# Altium schematic sheet 01.SchDoc
size A4
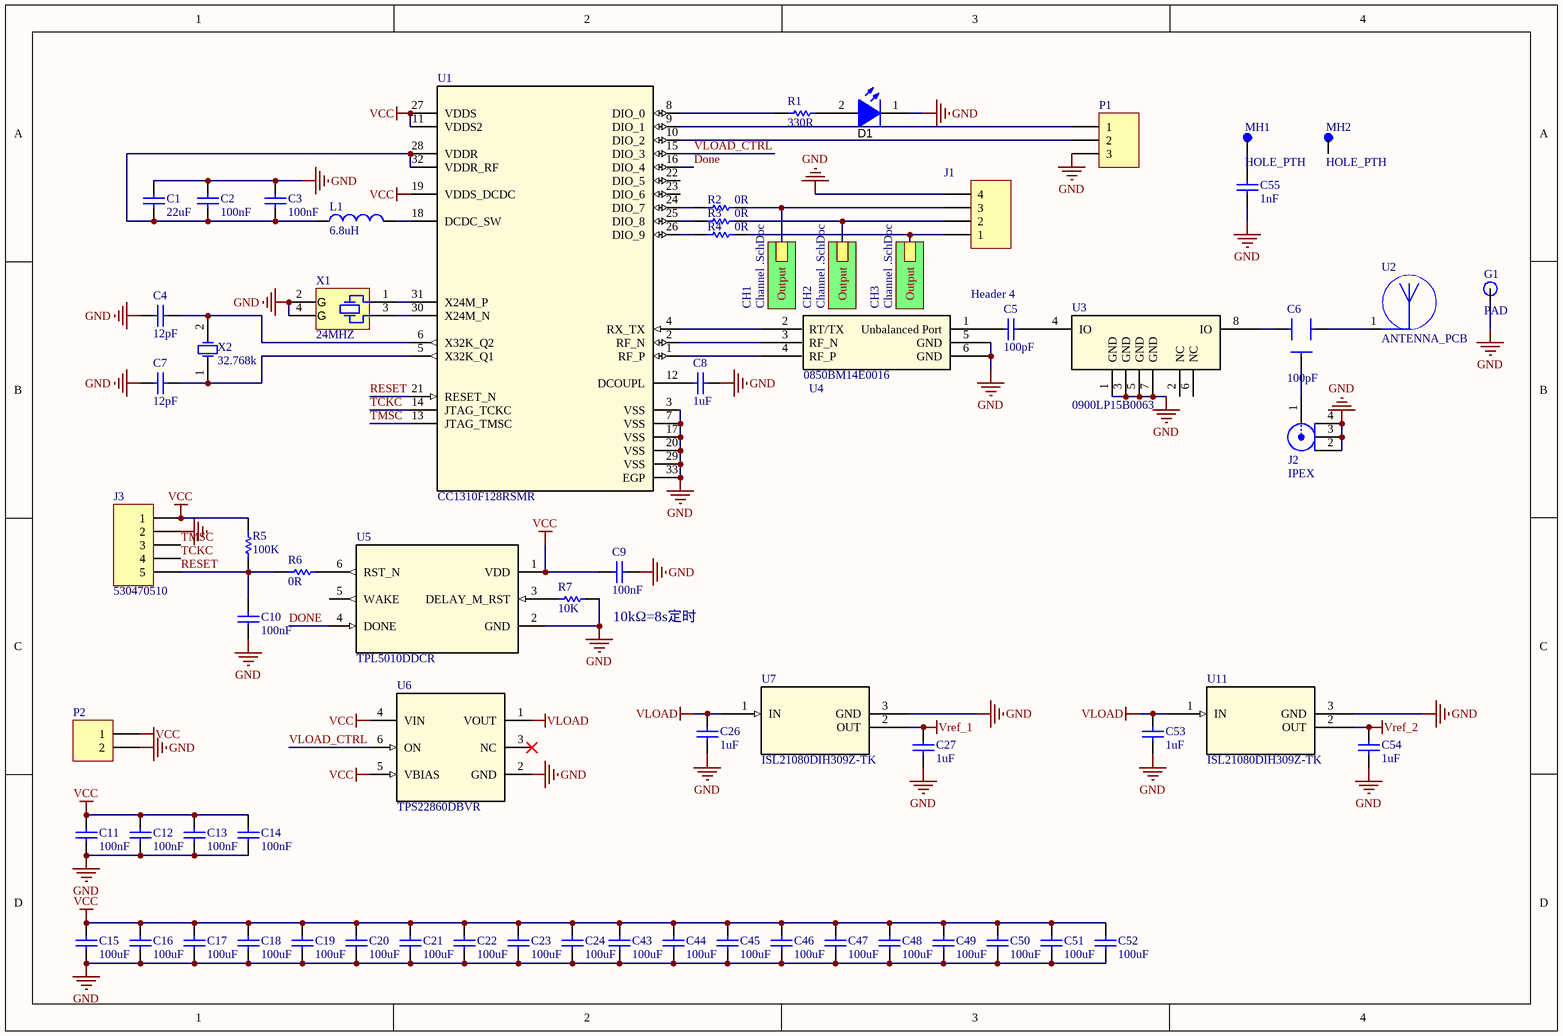
[diagram p0: 01.SchDoc]

## Parts
C1  22uF  [S0805C]
C2  100nF  [S0603C]
C3  100nF  [S0603C]
C4  12pF  [S0402C]
C5  100pF  [S0402C]
C6  100pF  [ST0402C]
C7  12pF  [S0402C]
C8  1uF  [S0603C]
C9  100nF  [S0603C]
C10  100nF  [S0603C]
C11  100nF  [S0603C]
C12  100nF  [S0603C]
C13  100nF  [S0603C]
C14  100nF  [S0603C]
C15  100uF  [S1210C]
C16  100uF  [S1210C]
C17  100uF  [S1210C]
C18  100uF  [S1210C]
C19  100uF  [S1210C]
C20  100uF  [S1210C]
C21  100uF  [S1210C]
C22  100uF  [S1210C]
C23  100uF  [S1210C]
C24  100uF  [S1210C]
C26  1uF  [S0603C]
C27  1uF  [S0603C]
C43  100uF  [S1210C]
C44  100uF  [S1210C]
C45  100uF  [S1210C]
C46  100uF  [S1210C]
C47  100uF  [S1210C]
C48  100uF  [S1210C]
C49  100uF  [S1210C]
C50  100uF  [S1210C]
C51  100uF  [S1210C]
C52  100uF  [S1210C]
C53  1uF  [S0603C]
C54  1uF  [S0603C]
C55  1nF  [S0805C]
D1  MHT192WDT-C2  [LED0603]  (value not drawn)
G1  PAD  [P3X2]
J1  Header 4  [CP1X4]
J2  IPEX  [molex-73412]
J3  530470510  [1.25mm_p5]
L1  6.8uH  [S0805L]
MH1  HOLE_PTH  [Pad_2-5_3]
MH2  HOLE_PTH  [Pad_2-5_3]
P1  Header 3  [CP1X3]  (value not drawn)
P2  Header 2  [CP1X2]  (value not drawn)
R1  330R  [S0603R]
R2  0R  [S0603R]
R3  0R  [S0603R]
R4  0R  [S0603R]
R5  100K  [S0603R]
R6  0R  [S0603R]
R7  10K  [S0603R]
U1  CC1310F128RSMR  [RSM0032B_NV]
U2  ANTENNA_PCB  [P1X1]
U3  0900LP15B0063  [8P0805]
U4  0850BM14E0016  [6P0603]
U5  TPL5010DDCR  [DDC0006A_N]
U6  TPS22860DBVR  [DBV0006A_N]
U7  ISL21080DIH309Z-TK  [SOT-23]
U11  ISL21080DIH309Z-TK  [SOT-23]
X1  24MHZ  [SMD-2016]
X2  32.768k  [SMD-2012]

## Sub-sheets
CH1 = Channel .SchDoc: Output
CH2 = Channel .SchDoc: Output
CH3 = Channel .SchDoc: Output

## Nets
GND: C1.1 C2.1 C3.1 C4.2 C7.2 C8.1 C9.2 C10.2 C11.2 C12.2 C13.2 C14.2 C15.1 C16.1 C17.1 C18.1 C19.1 C20.1 C21.1 C22.1 C23.1 C24.1 C26.2 C27.2 C43.1 C44.1 C45.1 C46.1 C47.1 C48.1 C49.1 C50.1 C51.1 C52.1 C53.2 C54.2 C55.1 D1.1(K) G1.1 J1.4 J2.2 J2.3 J2.4 J3.2 P1.3 P2.2 R7.2 U1.3(VSS) U1.7(VSS) U1.17(VSS) U1.20(VSS) U1.29(VSS) U1.33(EGP) U3.1(GND) U3.3(GND) U3.5(GND) U3.7(GND) U4.5(GND) U4.6(GND) U5.2(GND) U6.2(GND) U7.3(GND) U11.3(GND) X1.2(GND) X1.4(GND)
VCC: C9.1 C11.1 C12.1 C13.1 C14.1 C15.2 C16.2 C17.2 C18.2 C19.2 C20.2 C21.2 C22.2 C23.2 C24.2 C43.2 C44.2 C45.2 C46.2 C47.2 C48.2 C49.2 C50.2 C51.2 C52.2 J3.1 P2.1 R5.2 U1.11(VDDS2) U1.19(VDDS_DCDC) U1.27(VDDS) U5.1(VDD) U6.4(VIN) U6.5(VBIAS)
VLOAD: C26.1 C53.1 U6.1(VOUT) U7.1(IN) U11.1(IN)
Vref_1: C27.1 U7.2(OUT)
Vref_2: C54.1 U11.2(OUT)
DONE: U1.16(DIO_4) U5.4(DONE)
RESET: C10.1 J3.5 R5.1 R6.2 U1.21(RESET_N)
TCKC: J3.4 U1.14(JTAG_TCKC)
TMSC: J3.3 U1.13(JTAG_TMSC)
VLOAD_CTRL: U1.15(DIO_3) U6.6(ON)
NetC1_2: C1.2 C2.2 C3.2 L1.1 U1.28(VDDR) U1.32(VDDR_RF)
NetC4_1: C4.1 U1.6(X32K_Q2) X2.2(OSC2)
NetC5_1: C5.1 U4.1(Unbalanced_Port)
NetC5_2: C5.2 U3.4(IO)
NetC6_1: C6.1 U3.8(IO)
NetC6_2: C6.2 U2.1
NetC6_3: C6.3 J2.1
NetC7_1: C7.1 U1.5(X32K_Q1) X2.1(OSC1)
NetC8_2: C8.2 U1.12(DCOUPL)
NetC55_2: C55.2 MH1.1
NetD1_2: D1.2(A) R1.2
NetJ1_1: J1.1 R4.1 ; sheet CH3/Output
NetJ1_2: J1.2 R3.1 ; sheet CH2/Output
NetJ1_3: J1.3 R2.1 ; sheet CH1/Output
NetL1_2: L1.2 U1.18(DCDC_SW)
NetP1_1: P1.1 U1.9(DIO_1)
NetP1_2: P1.2 U1.10(DIO_2)
NetR1_1: R1.1 U1.8(DIO_0)
NetR2_2: R2.2 U1.24(DIO_7)
NetR3_2: R3.2 U1.25(DIO_8)
NetR4_2: R4.2 U1.26(DIO_9)
NetR6_1: R6.1 U5.6(RST_N)
NetR7_1: R7.1 U5.3(DELAY_M_RST)
NetU1_1: U1.1(RF_P) U4.4(RF_P)
NetU1_2: U1.2(RF_N) U4.3(RF_N)
NetU1_4: U1.4(RX_TX) U4.2(RT/TX)
NetU1_30: U1.30(X24M_N) X1.3
NetU1_31: U1.31(X24M_P) X1.1

Not connected (* = marked no-connect by the designer): MH2 1; U1 22(DIO_5) 23(DIO_6); U3 2(NC) 6(NC); U5 5(WAKE); U6 3(NC)*

## Notes on the sheet
- 10kΩ=8s定时
- (in symbol FA-128 24.000000MHz 12pF ±10ppm) G

## Library data of the parts
C1 = 22uF/0805/16V: 精度 ±20% / 容值 22uF / 额定电压 16V / 温漂系数（介质材料) X5R; Manufacturer: FH(风华); A_Manufacturer: 元六; Code: 0805X226M160NT; A_Code: J CT41-0805-2R2-16V-226M; CompType: Capacitor; A_ComType: 二类电容; DistributorCode: C129302; Package: 0805
C2 C3 C9-C14 = 100nF/0603/50V: 精度 ±10% / 容值 100nF / 额定电压 50V / 温漂系数（介质材料) X7R; Manufacturer: FH(风华); A_Manufacturer: 元六; Code: 0603B104K500NT; A_Code: J CT41-0603-2R1-50V-104K; CompType: Capacitor; A_ComType: 二类电容; DistributorCode: C30926; Package: 0603
C4 C7 = 12pF/0402/50V: 精度 ±1% / 容值 12pF / 额定电压 50V / 温漂系数（介质材料) C0G; Manufacturer: FH(风华); A_Manufacturer: 元六; Code: 0402CG120F500NT; A_Code: J CC41-0402-CG-50V-120J; CompType: Capacitor; A_ComType: 一类电容; DistributorCode: C182477; Package: 0402
C5 = 100pF/0402/50V: 精度 ±5% / 容值 100pF / 额定电压 50V / 温漂系数（介质材料) C0G; Manufacturer: FH(风华); A_Manufacturer: 元六; Code: 0402CG101J500NT; A_Code: J CC41-0402-CG-50V-101J; CompType: Capacitor; A_ComType: 一类电容; DistributorCode: C1546; Package: 0402
C6 = 100pF/0402/T: 精度 ±5% / 容值 100pF / 额定电压 50V / 温漂系数（介质材料) C0G; Manufacturer: FH(风华); A_Manufacturer: 元六; Code: 0402CG101J500NT; A_Code: J CC41-0402-CG-50V-101J; CompType: Capacitor; A_ComType: 一类电容; DistributorCode: C1546; Package: 0402
C8 C26 C27 C53 C54 = 1uF/0603/50V: 精度 ±10% / 容值 1uF / 额定电压 50V / 温漂系数（介质材料) X7R; Manufacturer: FH(风华); A_Manufacturer: 元六; Code: 0603B105K500NT; A_Code: J CT41-0603-2R1-50V-105M; CompType: Capacitor; A_ComType: 二类电容; DistributorCode: C90540; Package: 0603
C15-C24 C43-C52 = 100uF/1210/6.3V: 精度 ±20% / 容值 100uF / 额定电压 6.3V / 温漂系数（介质材料) X5R; Manufacturer: muRata(村田); A_Manufacturer: 元六; Code: GRM32ER60J107ME20L; A_Code: J CT41-1210-2R2-10V-107M; CompType: Capacitor; DistributorCode: C88154; Package: 1210
C55 = 1nF/0805/250V: 精度 ±10% / 容值 1nF / 额定电压 250V / 温漂系数（介质材料) X7R; Manufacturer: FH(风华); A_Manufacturer: 元六; Code: 0805B102K251NT; CompType: Capacitor; A_ComType: 二类电容; Package: 0805; DistributorCode: C285058
D1 = MHT192WDT-C2: LED SMD贴片0603顶部发光 / 黄色雾状胶体，高亮白色光 / 电压VF:2.6-3.1V@5mA / 亮度Iv:228-450mcd@5mA / 坐标x:0.3,y:0.3 / 发光角度:120deg; Manufacturer: MEIHUA(美华科技); CompType: LED; Code: MHT192WDT-C2; Package: 0603; DistributorCode: C389521; A_Code: -; A_ComType: -; A_Manufacturer: -
G1 = PAD: 地焊盘
J1 = Header 4: Header, 4-Pin; Code: -; CompType: -; DistributorCode: -; Manufacturer: -; Package: -; A_Code: -; A_ComType: -; A_Manufacturer: -
J2 = 73412-0110: RF同轴连接器（天线座）; Manufacturer: MOLEX; Code: 734120110; CompType: IPEX插座; DistributorCode: C434806; Package: SMD
J3 = 530470510: MX1.25 直插 镀锡 5P 针座; Manufacturer: MOLEX; CompType: 连接器; Code: 530470510; DistributorCode: C471412; Package: 1.25mm 5p; A_Code: -; A_ComType: -; A_Manufacturer: -
L1 = 6.8uH/0805_1: 精度 ±20% / 电感值 6.8uH / 直流电阻（内阻） 400mΩ / 额定电流 220mA; Manufacturer: TDK; A_Manufacturer: 振华富; Code: MLZ2012M6R8HT000; A_Code: PI2012F6R8; CompType: Inductor; DistributorCode: C524463; Package: 0805; A_ComType: -
MH1 MH2 = HOLE_2-5_3: 定位孔; Code: -; CompType: -; DistributorCode: -; Manufacturer: -; Package: -; A_Code: -; A_ComType: -; A_Manufacturer: -
P1 = Header 3: Header, 3-Pin; Code: -; CompType: -; DistributorCode: -; Manufacturer: -; Package: -; A_Code: -; A_ComType: -; A_Manufacturer: -
P2 = Header 2: Header, 2-Pin; Code: -; CompType: -; DistributorCode: -; Manufacturer: -; Package: -; A_Code: -; A_ComType: -; A_Manufacturer: -
R1 = 330R/0603: 精度 ±1% / 温度系数 ±100ppm/℃ / 阻值 330Ω / 功率 0.1W; Manufacturer: FH(风华); A_Manufacturer: 718; Code: RS-03K3300FT; A_Code: J-RM1608(0603)-K-B-330R-F; CompType: Resistor; A_ComType: RM型片式膜固定电阻器; DistributorCode: C125768; Package: 0603
R2-R4 R6 = 0R/0603: 精度 ±1% / 阻值 0Ω / 功率 0.1W; Manufacturer: FH(风华); A_Manufacturer: 718; Code: RS-03000FT; A_Code: J-RM1608(0603)-K-B-0R-F; CompType: Resistor; A_ComType: RM型片式膜固定电阻器; DistributorCode: C136582; Package: 0603
R5 = 100K/0603: 精度 ±1% / 阻值 100kΩ / 温度系数 ±100ppm/℃ / 功率 0.1W; Manufacturer: FH(风华); A_Manufacturer: 718; Code: RS-03K1003FT; A_Code: J-RM1608(0603)-K-B-100K-F; CompType: Resistor; A_ComType: RM型片式膜固定电阻器; DistributorCode: C115320; Package: 0603
R7 = 10K/0603: 精度 ±1% / 温度系数 ±100ppm/℃ / 阻值 10kΩ / 功率 0.1W; Manufacturer: FH(风华); A_Manufacturer: 718; Code: RS-03K1002FT; A_Code: J-RM1608(0603)-K-B-10K-F; CompType: Resistor; A_ComType: RM型片式膜固定电阻器; DistributorCode: C115324; Package: 0603
U1 = CC1310F128RSMR: RF-MCU; Manufacturer: TI(德州仪器); CompType: MCU; Code: CC1310F128RSMR; Package: VQFN-32
U3 = 0900LP15B0063: 863 - 960MHz / -40 to +85°C / 3Fo Attenuation (2589-2784MHz) 50dB / 2Fo Attenuation (1726-1856MHz) 59dB /; Manufacturer: Johanson Technology; CompType: 低通; Code: 0900LP15B0063; DistributorCode: *; Package: 8P0805
U4 = 0850BM14E0016: 770 - 860 860 - 928MHz / -40°C to +85°C / Pmax 2W; Manufacturer: Johanson Technology; CompType: Balun; Code: 0850BM14E0016; DistributorCode: -; Package: 6P0603; A_Code: -; A_ComType: -; A_Manufacturer: -
U5 = TPL5010DDCR: 看门狗; Manufacturer: TI(德州仪器); Code: TPL5010DDCR; DistributorCode: C473912; Package: SOT23-Thin-6; CompType: 看门狗; A_Code: -; A_ComType: -; A_Manufacturer: -
U6 = TPS22860DBVR: 负载开关; Manufacturer: TI(德州仪器); CompType: 模拟开关; Code: TPS22860DBVR; DistributorCode: C132005; Package: SOT23-6
U7 U11 = ISL21080DIH309Z-TK: 输出电压（最小值/固定） 0.9V / 输出电流 7mA / 输出电压（最大值） - / 输入电压 2 V ~ 5.5 V / 电源电流 1.5uA / 输出类型 固定 / 工作温度 -40°C ~ 85°C(TA) / 温度系数 50ppm/°C / 阴极电流 - / 精度 ±0.7% / 参考源类型 系列; Manufacturer: Intersil(英特矽尔); CompType: 电源参考; DistributorCode: C152443; Package: SOT23-3; Code: ISL21080DIH309Z-TK
X1 = FA-128 24.000000MHz 12pF ±10ppm: 商品目录 贴片晶体谐振器（无源） / 等效串联电阻（ESR） 60Ω / 晶振类型 无源贴片晶振 / 主频 24MHz / 频率公差 ±10ppm / 负载电容值 12pF / 工作温度 -40℃~85℃; Manufacturer: EPSON(爱普生); CompType: 晶振; Code: FA-128 24.000000MHz 12pF ±10ppm; DistributorCode: C255882; Package: SMD-2016; A_Code: -; A_ComType: -; A_Manufacturer: -
X2 = X1A000061002100: X1A000061002100 / 等效串联电阻（ESR） 90kΩ / 晶振类型 无源贴片晶振 / 主频 32.768KHz / 频率公差 ±20ppm / 负载电容值 6pF / 工作温度 -40℃ ~ +85℃; Manufacturer: EPSON(爱普生); Code: FC-12M 32.768kHz 6pF ±20ppm; CompType: 晶振; DistributorCode: C255767; Package: SMD-2012; A_Code: -; A_ComType: -; A_Manufacturer: -
U2 = ANTENNA_PCB: Manufacturer: -; Code: -; DistributorCode: -; Package: P1X1